# Altium schematic sheet USB.SchDoc
size A4
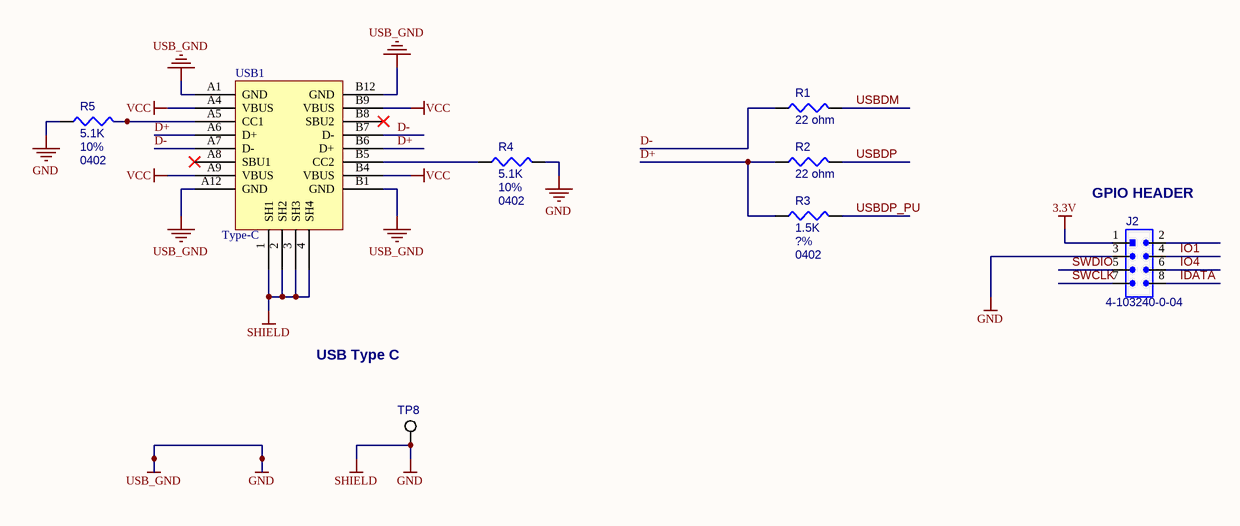
[diagram p0: USB.SchDoc]

## Parts
J2  4-103240-0-04  [4-103240-0-04]
R1  22 ohm  [RESISTOR_0402]
R2  22 ohm  [RESISTOR_0402]
R3  1.5K  Package: 0402  Tolerance: ?%  [RESISTOR_0402]
R4  5.1K  Package: 0402  Tolerance: 10%  [RES_0402]
R5  5.1K  Package: 0402  误差: 10%  [RES_0402]
TP8  TEST POINT  [TEST_POINT_PAD]  (value not drawn)  (no BOM)
USB1  Type-C  [Type-C-TOP]

## Nets
3.3V: J2.1
GND: J2.3 R4.2 R5.1 TP8.1 USB1.1(SH1) USB1.2(SH2) USB1.3(SH3) USB1.4(SH4) USB1.A1(GND) USB1.A12(GND) USB1.B1(GND) USB1.B12(GND)  [also labelled SHIELD, USB_GND]
VCC: USB1.A4(VBUS) USB1.A9(VBUS) USB1.B4(VBUS) USB1.B9(VBUS)
D+: R2.1 R3.1 USB1.A6(D+) USB1.B6(D+)
D-: R1.1 USB1.A7(D-) USB1.B7(D-)
IDATA: J2.8
IO1: J2.4
IO4: J2.6
SWCLK: J2.7
SWDIO: J2.5
USBDM: R1.2
USBDP: R2.2
USBDP_PU: R3.2
NetR4_1: R4.1 USB1.B5(CC2)
NetR5_2: R5.2 USB1.A5(CC1)

Not connected (* = marked no-connect by the designer): J2 2; USB1 A8(SBU1)* B8(SBU2)*

## Notes on the sheet
- (near J2) GPIO HEADER
- USB Type C

## Library data of the parts
J2 = 4-103240-0-04: CONNECTOR, HEADER, 2X4, 0.1" PITCH; Manufacturer: TE CONNECTIVITY; Part Number: 4-103240-0-04; Pitch: 0.1"
R1 R2 = RESISTOR: RES, 22 OHM, 1/10W, ?%, 0402; Manufacturer: PANASONIC; Part Number: ERJ-2RKF22R0X; Power Rating: 1/10W; Package: 0402; Tolerance: ?%
R3-R5 = RESISTOR: RES, 1.5K OHM, 1/10W, ?%, 0402; Manufacturer: PANASONIC; Part Number: ERJ-2RKF1501X; Power Rating: 1/10W
TP8 = TEST_POINT: Manufacturer: *; Part Number: *
USB1 = USB-Type-C-TOP-16P: 16脚USB TypeC